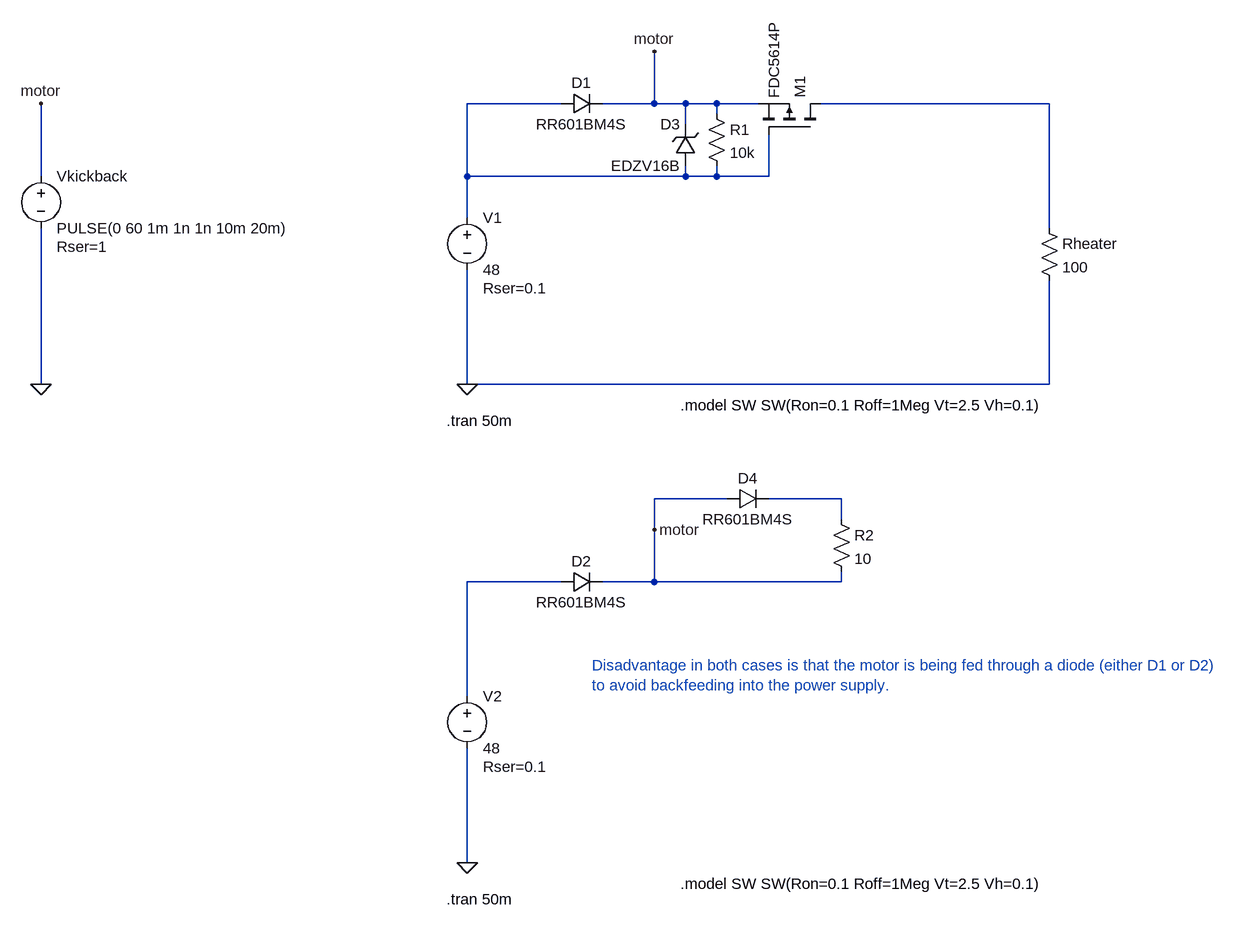
[diagram p0: schematic kickback_energy_storage.asc]
kickback_energy_storage.asc, the LTspice schematic file:
Version 4
SHEET 1 1084 1192
WIRE -32 -48 -176 -48
WIRE 112 -48 112 -128
WIRE 112 -48 32 -48
WIRE 160 -48 112 -48
WIRE 208 -48 160 -48
WIRE 272 -48 208 -48
WIRE 720 -48 368 -48
WIRE 208 -32 208 -48
WIRE 160 -16 160 -48
WIRE -832 64 -832 -48
WIRE -176 64 -176 -48
WIRE 160 64 160 48
WIRE 160 64 -176 64
WIRE 208 64 208 48
WIRE 208 64 160 64
WIRE 288 64 288 0
WIRE 288 64 208 64
WIRE -176 128 -176 64
WIRE 720 144 720 -48
WIRE -832 384 -832 144
WIRE -176 384 -176 208
WIRE 720 384 720 224
WIRE 720 384 -176 384
WIRE 224 560 112 560
WIRE 400 560 288 560
WIRE 400 592 400 560
WIRE 112 608 112 560
WIRE -32 688 -176 688
WIRE 112 688 112 608
WIRE 112 688 32 688
WIRE 400 688 400 672
WIRE 400 688 112 688
WIRE -176 864 -176 688
WIRE -176 1120 -176 944
FLAG -176 384 0
FLAG -832 384 0
FLAG -832 -48 motor
FLAG 112 -128 motor
FLAG -176 1120 0
FLAG 112 608 motor
SYMBOL voltage -176 112 R0
WINDOW 123 0 0 Left 0
WINDOW 39 24 124 Left 2
SYMATTR SpiceLine Rser=0.1
SYMATTR InstName V1
SYMATTR Value 48
SYMBOL res 704 128 R0
SYMATTR InstName Rheater
SYMATTR Value 100
SYMBOL diode -32 -32 R270
WINDOW 0 32 32 VTop 2
WINDOW 3 0 32 VBottom 2
SYMATTR InstName D1
SYMATTR Value RR601BM4S
SYMBOL voltage -832 48 R0
WINDOW 123 0 0 Left 0
WINDOW 39 24 124 Left 2
SYMATTR SpiceLine Rser=1
SYMATTR InstName Vkickback
SYMATTR Value PULSE(0 60 1m 1n 1n 10m 20m)
SYMBOL pmos 368 0 M270
SYMATTR InstName M1
SYMATTR Value FDC5614P
SYMBOL zener 176 48 R180
WINDOW 0 24 64 Left 2
WINDOW 3 24 0 Left 2
SYMATTR InstName D3
SYMATTR Value EDZV16B
SYMATTR Description Diode
SYMATTR Type diode
SYMBOL res 192 -48 R0
SYMATTR InstName R1
SYMATTR Value 10k
SYMBOL voltage -176 848 R0
WINDOW 123 0 0 Left 0
WINDOW 39 24 124 Left 2
SYMATTR SpiceLine Rser=0.1
SYMATTR InstName V2
SYMATTR Value 48
SYMBOL diode -32 704 R270
WINDOW 0 32 32 VTop 2
WINDOW 3 0 32 VBottom 2
SYMATTR InstName D2
SYMATTR Value RR601BM4S
SYMBOL diode 224 576 R270
WINDOW 0 32 32 VTop 2
WINDOW 3 0 32 VBottom 2
SYMATTR InstName D4
SYMATTR Value RR601BM4S
SYMBOL res 384 576 R0
SYMATTR InstName R2
SYMATTR Value 10
TEXT 152 416 Left 2 !.model SW SW(Ron=0.1 Roff=1Meg Vt=2.5 Vh=0.1)
TEXT -208 440 Left 2 !.tran 50m
TEXT 152 1152 Left 2 !.model SW SW(Ron=0.1 Roff=1Meg Vt=2.5 Vh=0.1)
TEXT -208 1176 Left 2 !.tran 50m
TEXT 16 816 Left 2 ;Disadvantage in both cases is that the motor is being fed through a diode (either D1 or D2) \nto avoid backfeeding into the power supply.

The netlist it stands for:
* kickback_energy_storage.asc
V1 N001 0 48 Rser=0.1
Rheater N002 0 100
D1 N001 motor RR601BM4S
Vkickback motor 0 PULSE(0 60 1m 1n 1n 10m 20m) Rser=1
M1 N002 N001 motor motor FDC5614P
D3 N001 motor EDZV16B
R1 motor N001 10k
V2 N004 0 48 Rser=0.1
D2 N004 motor RR601BM4S
D4 motor N003 RR601BM4S
R2 N003 motor 10
.model D D
.lib standard.dio
.model NMOS NMOS
.model PMOS PMOS
.lib standard.mos
.model SW SW(Ron=0.1 Roff=1Meg Vt=2.5 Vh=0.1)
.tran 50m
.model SW SW(Ron=0.1 Roff=1Meg Vt=2.5 Vh=0.1)
.tran 50m
* Disadvantage in both cases is that the motor is being fed through a diode (either D1 or D2)
* to avoid backfeeding into the power supply.
.backanno
.end